# EAGLE design Alimentacion_piano_v2.0 (EAGLE 5.11)
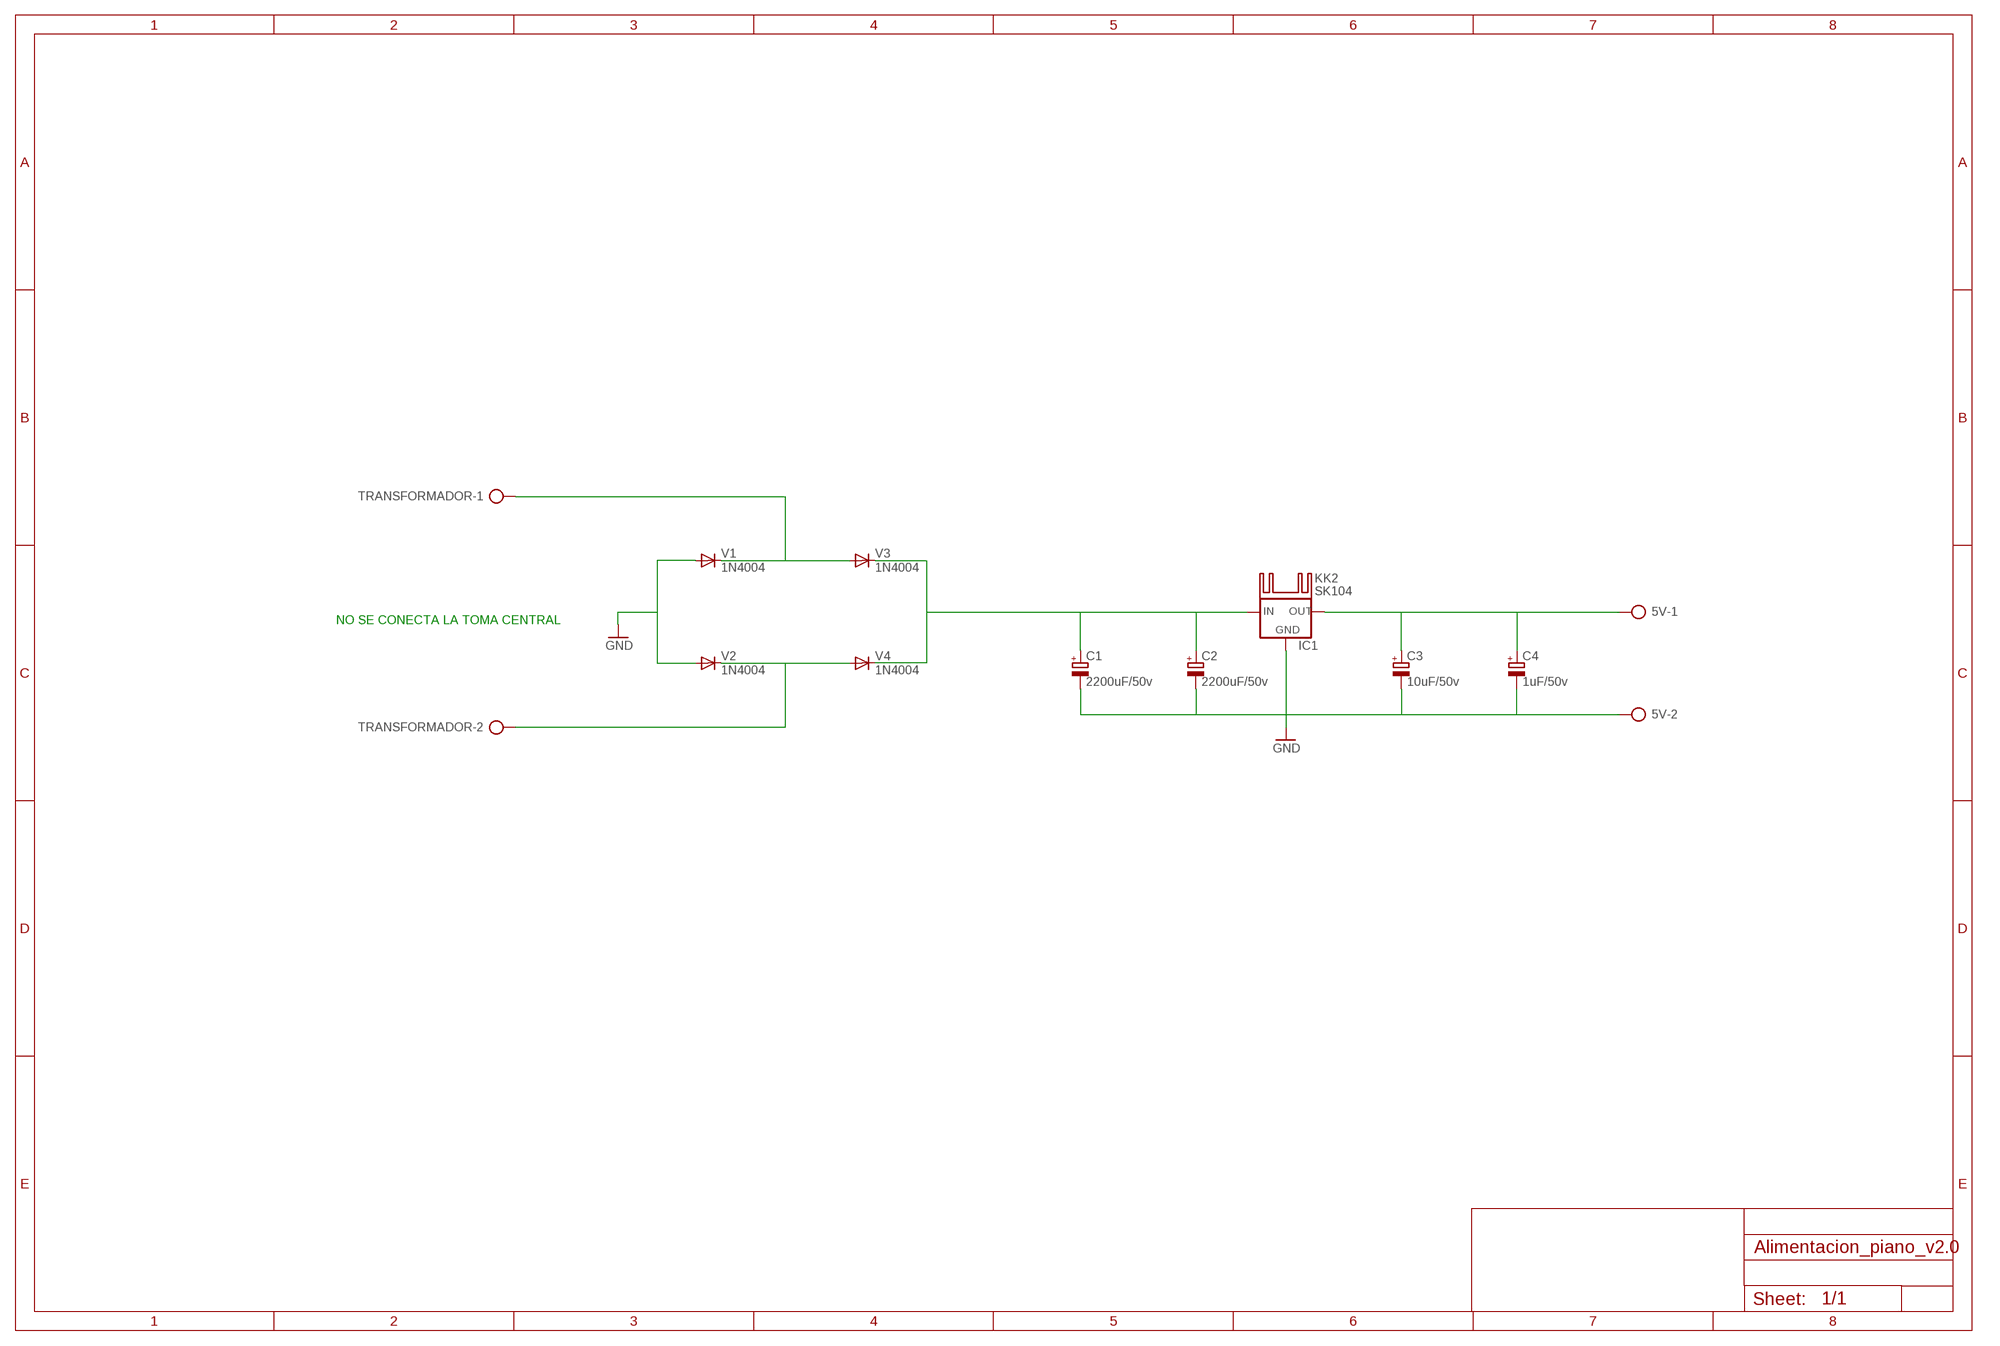
[diagram p0: schematic, sheet 1]

## Parts
5V  AK500/2  [AK500/2]
C1  2200uF/50v  CPOL-EUE7.5-18  [E7,5-18]
C2  2200uF/50v  CPOL-EUE7.5-18  [E7,5-18]
C3  10uF/50v  CPOL-EUE2-5  [E2-5]
C4  1uF/50v  CPOL-EUE2-5  [E2-5]
IC1  78XXS  [78XXS]
KK2  SK104  [SK104]
TRANSFORMADOR  AK500/2  [AK500/2]
V1  1N4004  [DO41-10]
V2  1N4004  [DO41-10]
V3  1N4004  [DO41-10]
V4  1N4004  [DO41-10]

## Nets
GND: 5V.2 C1.- C2.- C3.- C4.- IC1.GND V1.A V2.A
N$2: TRANSFORMADOR.1 V1.C V3.A
N$3: TRANSFORMADOR.2 V2.C V4.A
N$4: C1.+ C2.+ IC1.IN V3.C V4.C
N$6: 5V.1 C3.+ C4.+ IC1.OUT

## Notes on the sheet
- NO SE CONECTA LA TOMA CENTRAL

## Library data of the parts
5V TRANSFORMADOR = con-ptr500:AK500/2: CONNECTOR; OC_FARNELL: unknown; OC_NEWARK: unknown
C1-C4 = rcl:CPOL-EU: POLARIZED CAPACITOR, European symbol
IC1 = v-reg:78XXS: VOLTAGE REGULATOR
KK2 = heatsink:SK104: HEATSINK manufacturer Fischer/distributor Buerklin
V1-V4 = diode:1N4004: DIODE general purpose rectifier, 1 A

## Board
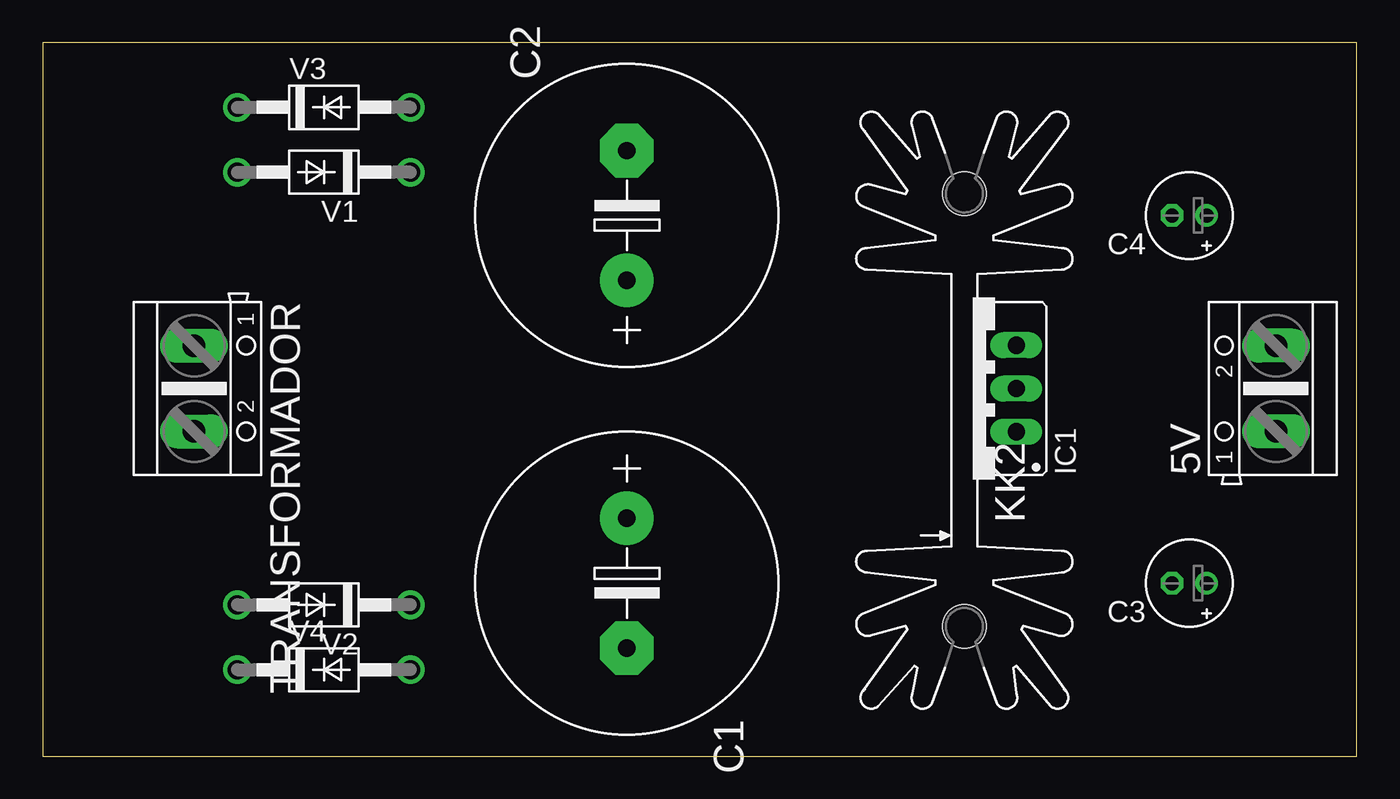
[diagram p1: board, top side]
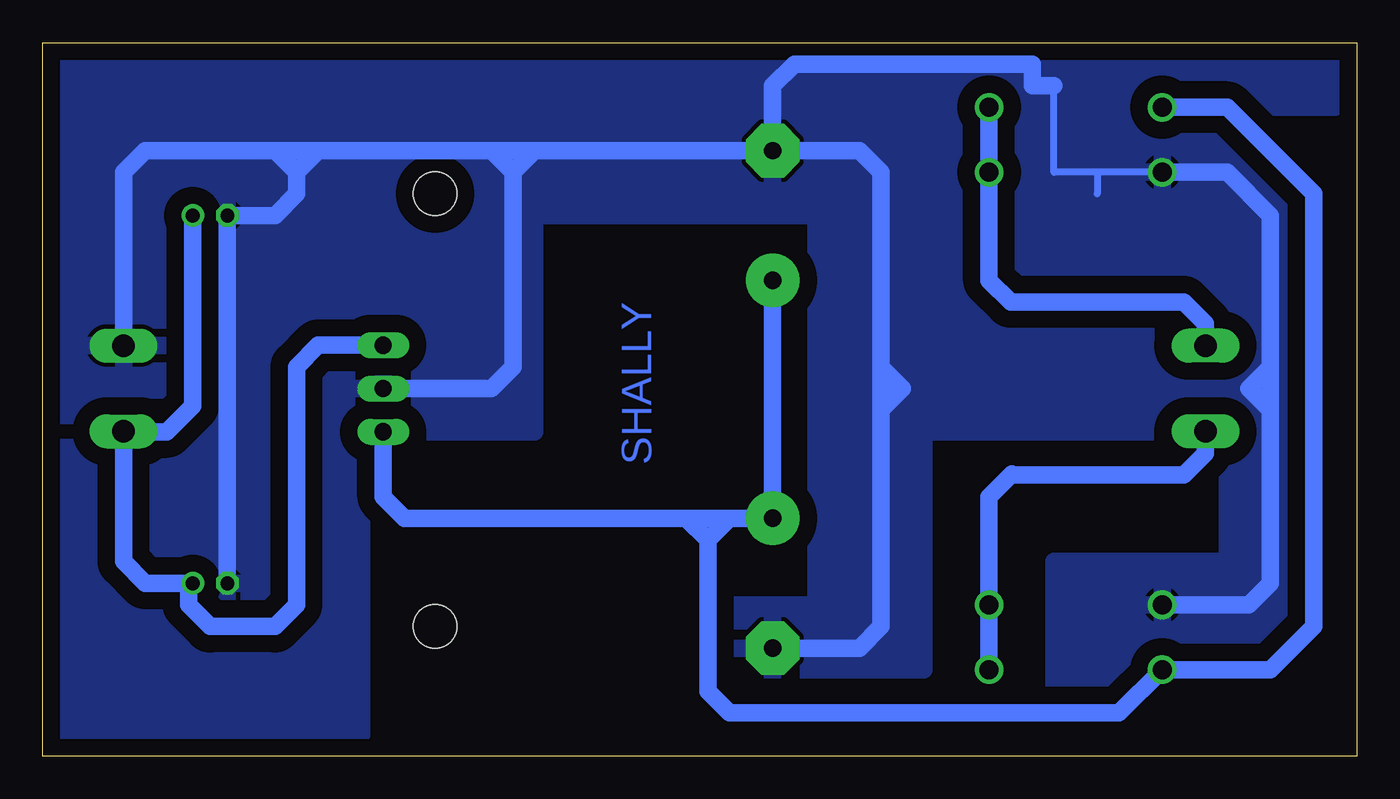
[diagram p2: board, bottom side, seen from below]

Size 77.14 x 41.9 mm. Coordinates in mm from the lower left corner, seen from the top.
Outline: 0,0 77.14,0 77.14,41.9 0,41.9 0,0
Copper layers (1*16): Top 0.035mm / dielectric 1.5mm / Bottom 0.035mm
Design rules "default *": minimum track width 10mil, minimum drill 24mil, track to track 40mil, track to pad 40mil, pad to pad 8mil, via to via 8mil, smd to smd 8mil, copper to edge 40mil, drill to drill 8mil, minimum pad ring 10mil, minimum via ring 8mil, stop-mask expansion 4mil, vias tented up to drill 0mil, thermal gap 10mil

### Footprints (pad centres in the part's own frame; a part is rotated, then mirrored left to right if it is on the bottom)
AK500/2 = drill 1.321 long: 1 -2.515,0; 2 2.515,0
E7,5-18 = drill 1.016 pad 3.15 round: + -3.81,0 | drill 1.016 pad 3.15 octagon: - 3.81,0
E2-5 = drill 0.813 pad 1.27 round: + -1.016,0 | drill 0.813 pad 1.27 octagon: - 1.016,0
78XXS = drill 1.016 long: GND 0,-2.54; IN -2.54,-2.54; OUT 2.54,-2.54
SK104 = hole 2.54: -12.7,-0.762; 12.7,-0.762
DO41-10 = drill 1.118 round: A 5.08,0; C -5.08,0

### Placement (x,y rotation side)
5V  72.39,21.59 90 top
C1  34.29,10.16 270 top
C2  34.29,31.75 90 top
C3  67.31,10.16 180 top
C4  67.31,31.75 180 top
IC1  54.61,21.59 90 top
KK2  53.34,20.32 90 top
TRANSFORMADOR  8.89,21.59 270 top
V1  16.51,34.29 180 top
V2  16.51,8.89 180 top
V3  16.51,38.1 0 top
V4  16.51,5.08 0 top

### Tracks (layer width: path | path; a pad name or v marks a point on that pad's centre or on a via)
GND
  Bottom 0.406: V1.A 15.24,34.29 | 15.24,34.29 15.24,33.02 | 15.24,34.29 17.78,34.29 17.78,39.37
  Bottom 1.016: V2.A 6.35,8.89 5.08,10.16 5.08,20.32 | V1.A 7.62,34.29 5.08,31.75 5.08,22.86 | 5.08,22.86 6.35,21.59 5.08,20.32 | 5.08,20.32 5.08,22.86 | C1.- 29.21,6.35 27.94,7.62 27.94,20.32 | 26.67,21.59 27.94,20.32 | 27.94,21.59 26.67,21.59 | 27.94,21.59 27.94,20.32 | 27.94,22.86 27.94,21.59 | 27.94,22.86 26.67,21.59 | 27.94,22.86 27.94,34.29 29.21,35.56 C2.- | C3.- C4.- 63.5,31.75 62.23,33.02 62.23,34.29 | C2.- 48.26,35.56 | 60.96,35.56 62.23,34.29 | 5V.2 72.39,34.29 71.12,35.56 63.5,35.56 | 60.96,35.56 63.5,35.56 | 62.23,34.29 63.5,35.56 | IC1.GND 50.8,21.59 49.53,22.86 49.53,34.29 | 48.26,35.56 49.53,34.29 | 48.26,35.56 50.8,35.56 | 49.53,34.29 50.8,35.56 | 50.8,35.56 60.96,35.56 | 17.78,39.37 19.05,39.37 19.05,40.64 33.02,40.64 34.29,39.37 C2.-
  pour Bottom: 7.62,36.83 1.52,36.83 arc90 1.27,36.58 1.27,1.27 17.53,1.27 arc90 17.78,4.06 17.78,11.43 7.87,11.43 arc-90 7.62,11.68 7.62,19.05 25.15,19.05 arc-90 25.4,18.8 25.4,5.08 40.39,5.08 arc90 40.64,5.33 40.64,8.89 32,8.89 arc-90 31.75,9.14 31.75,31.75 48.01,31.75 arc-90 48.26,31.5 48.26,19.05 58.17,19.05 arc-90 58.42,18.8 58.42,1.27 77.47,1.27 77.47,41.91 5.33,41.91 arc90 1.27,41.66 1.27,38.1 7.37,38.1 arc-90 7.62,37.85
N$2
  Bottom 1.016: V3.A V1.C 21.59,27.94 20.32,26.67 10.16,26.67 8.89,25.4 TRANSFORMADOR.1
N$3
  Bottom 1.016: V4.A V2.C 21.59,15.24 20.24,16.59 20.17,16.51 10.16,16.51 8.89,17.78 TRANSFORMADOR.2
N$4
  Bottom 1.016: V3.C 7.62,38.1 2.54,33.02 2.54,7.62 5.08,5.08 V4.C 13.97,2.54 36.83,2.54 38.1,3.81 38.1,12.7 | C2.+ C1.+ 36.83,13.97 | 39.37,13.97 36.83,13.97 | 38.1,12.7 39.37,13.97 | 38.1,12.7 36.83,13.97 | IC1.IN 57.15,15.24 55.88,13.97 39.37,13.97
N$6
  Bottom 1.016: C4.+ 68.33,20.57 69.85,19.05 71.09,19.05 5V.1 72.39,11.43 71.12,10.16 C3.+ 68.58,9.91 68.58,8.89 67.31,7.62 63.5,7.62 62.23,8.89 62.23,22.86 60.96,24.13 IC1.OUT

### Text on the board
Bottom: SHALLY